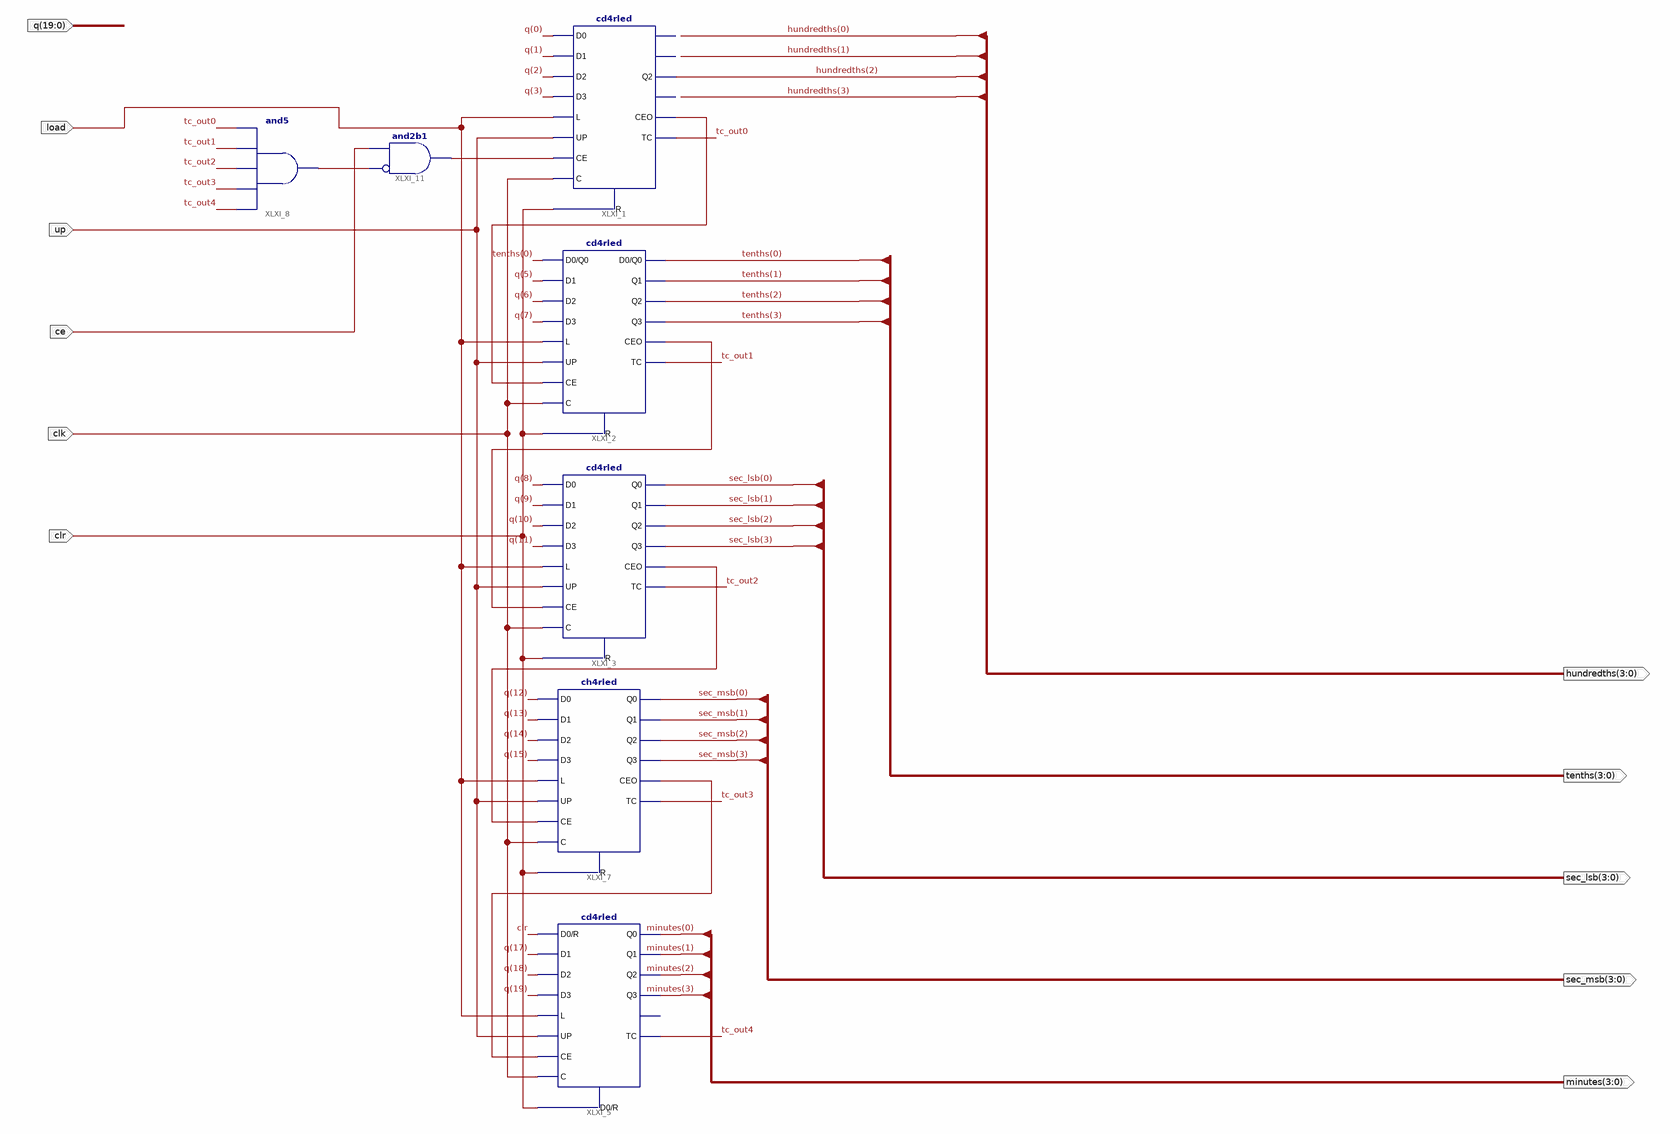
[diagram p0: schematic sheet 1]
// Xilinx ISE schematic time_cnt.sch (spartan3a) as structural Verilog: 7 symbols, 11 ports
module time_cnt (
  input  [19:0] q,
  input  load,
  input  up,
  input  ce,
  input  clk,
  input  clr,
  output [3:0] sec_msb,
  output [3:0] sec_lsb,
  output [3:0] tenths,
  output [3:0] hundredths,
  output [3:0] minutes
);

  wire tc_out0, tc_out1, tc_out2, tc_out3, tc_out4, XLXN_5, XLXN_15, XLXN_18, XLXN_19, XLXN_20, XLXN_21;

  cd4rled XLXI_2 (
    .C(clk), .CE(XLXN_18), .CEO(XLXN_19), .D0(tenths[0]), .D1(q[5]), .D2(q[6]), .D3(q[7]), .L(load),
    .Q0(tenths[0]), .Q1(tenths[1]), .Q2(tenths[2]), .Q3(tenths[3]), .TC(tc_out1), .UP(up), .R(clr));
  cd4rled XLXI_3 (
    .C(clk), .CE(XLXN_19), .CEO(XLXN_20), .D0(q[8]), .D1(q[9]), .D2(q[10]), .D3(q[11]), .L(load),
    .Q0(sec_lsb[0]), .Q1(sec_lsb[1]), .Q2(sec_lsb[2]), .Q3(sec_lsb[3]), .TC(tc_out2), .UP(up), .R(clr));
  cd4rled XLXI_5 (
    .C(clk), .CE(XLXN_21), .D0(clr), .D1(q[17]), .D2(q[18]), .D3(q[19]), .L(load), .Q0(minutes[0]),
    .Q1(minutes[1]), .Q2(minutes[2]), .Q3(minutes[3]), .TC(tc_out4), .UP(up), .R(clr));  // open: CEO
  ch4rled XLXI_7 (
    .C(clk), .CE(XLXN_20), .CEO(XLXN_21), .D0(q[12]), .D1(q[13]), .D2(q[14]), .D3(q[15]), .L(load),
    .Q0(sec_msb[0]), .Q1(sec_msb[1]), .Q2(sec_msb[2]), .Q3(sec_msb[3]), .TC(tc_out3), .UP(up), .R(clr));
  and XLXI_8 (XLXN_5, tc_out4, tc_out3, tc_out2, tc_out1, tc_out0);
  cd4rled XLXI_1 (
    .C(clk), .CE(XLXN_15), .CEO(XLXN_18), .D0(q[0]), .D1(q[1]), .D2(q[2]), .D3(q[3]), .L(load),
    .Q2(hundredths[2]), .TC(tc_out0), .UP(up), .R(clr));  // open: Q0, Q1, Q3
  and XLXI_11 (XLXN_15, ~XLXN_5, ce);  // and2b1
endmodule
